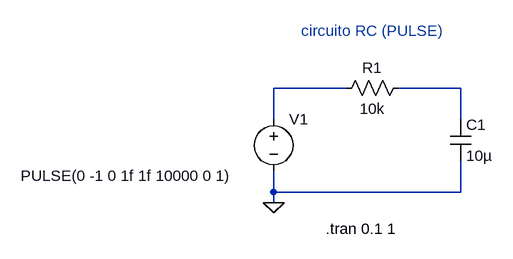
[diagram p0: schematic circuitoRCv1.asc]
circuitoRCv1.asc, the LTspice schematic file:
Version 4
SHEET 1 880 680
WIRE 224 304 112 304
WIRE 400 304 304 304
WIRE 112 352 112 304
WIRE 400 352 400 304
WIRE 112 464 112 432
WIRE 400 464 400 416
WIRE 400 464 112 464
WIRE 112 480 112 464
FLAG 112 480 0
SYMBOL Voltage 112 336 R0
WINDOW 3 -389 103 Left 2
SYMATTR Value PULSE(0 -1 0 1f 1f 10000 0 1)
SYMATTR InstName V1
SYMBOL Cap 384 352 R0
SYMATTR InstName C1
SYMATTR Value 10µ
SYMBOL Res 208 320 R270
WINDOW 0 32 56 VTop 2
WINDOW 3 0 56 VBottom 2
SYMATTR InstName R1
SYMATTR Value 10k
TEXT 264 216 Center 2 ;circuito RC (PULSE)
TEXT 192 520 Left 2 !.tran 0.1 1

The netlist it stands for:
* circuitoRCv1.asc
V1 N001 0 PULSE(0 -1 0 1f 1f 10000 0 1)
C1 N002 0 10µ
R1 N001 N002 10k
* circuito RC (PULSE)
.tran 0.1 1
.backanno
.end